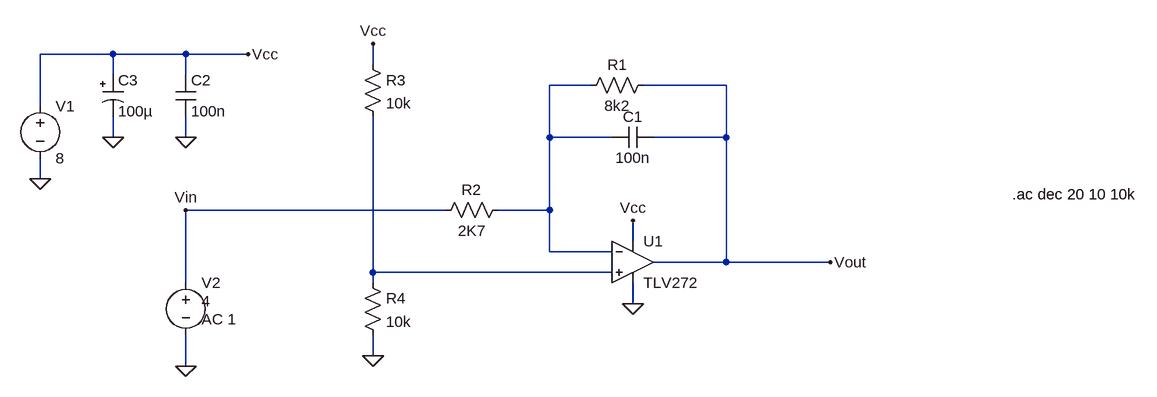
[diagram p0: schematic Exp1.B.2.asc]
Exp1.B.2.asc, the LTspice schematic file:
Version 4
SHEET 1 1456 680
WIRE -160 -96 -272 -96
WIRE -48 -96 -160 -96
WIRE 48 -96 -48 -96
WIRE 240 -80 240 -112
WIRE -160 -64 -160 -96
WIRE -48 -64 -48 -96
WIRE 576 -48 512 -48
WIRE 784 -48 656 -48
WIRE -272 -16 -272 -96
WIRE -160 32 -160 0
WIRE -48 32 -48 0
WIRE 512 32 512 -48
WIRE 608 32 512 32
WIRE 784 32 784 -48
WIRE 784 32 672 32
WIRE -272 96 -272 64
WIRE 352 144 -48 144
WIRE 512 144 512 32
WIRE 512 144 432 144
WIRE 640 192 640 160
WIRE 512 208 512 144
WIRE 608 208 512 208
WIRE 784 224 784 32
WIRE 784 224 672 224
WIRE 944 224 784 224
WIRE 240 240 240 0
WIRE 608 240 240 240
WIRE -48 256 -48 144
WIRE 240 256 240 240
WIRE 640 288 640 256
WIRE 240 368 240 336
WIRE -48 384 -48 336
FLAG -48 384 0
FLAG -272 96 0
FLAG -160 32 0
FLAG -48 32 0
FLAG 48 -96 Vcc
FLAG 240 368 0
FLAG 240 -112 Vcc
FLAG 640 288 0
FLAG -48 144 Vin
FLAG 944 224 Vout
FLAG 640 160 Vcc
SYMBOL voltage -48 240 R0
WINDOW 3 24 44 Left 2
WINDOW 123 24 72 Left 2
WINDOW 39 0 0 Left 0
SYMATTR Value 4
SYMATTR Value2 AC 1
SYMATTR InstName V2
SYMBOL res 224 240 R0
SYMATTR InstName R4
SYMATTR Value 10k
SYMBOL res 224 -96 R0
SYMATTR InstName R3
SYMATTR Value 10k
SYMBOL res 336 160 R270
WINDOW 0 32 56 VTop 2
WINDOW 3 0 56 VBottom 2
SYMATTR InstName R2
SYMATTR Value 2K7
SYMBOL res 560 -32 R270
WINDOW 0 32 56 VTop 2
WINDOW 3 0 56 VBottom 2
SYMATTR InstName R1
SYMATTR Value 8k2
SYMBOL voltage -272 -32 R0
WINDOW 123 0 0 Left 0
WINDOW 39 0 0 Left 0
SYMATTR InstName V1
SYMATTR Value 8
SYMBOL cap -64 -64 R0
SYMATTR InstName C2
SYMATTR Value 100n
SYMBOL polcap -176 -64 R0
SYMATTR InstName C3
SYMATTR Value 100µ
SYMBOL OpAmps\\TLV272 640 224 R0
SYMATTR InstName U1
SYMBOL cap 672 16 R90
WINDOW 0 0 32 VBottom 2
WINDOW 3 32 32 VTop 2
SYMATTR InstName C1
SYMATTR Value 100n
TEXT 1224 120 Left 2 !.ac dec 20 10 10k

The netlist it stands for:
* Exp1.B.2.asc
V2 Vin 0 4 AC 1
R4 N002 0 10k
R3 Vcc N002 10k
R2 Vin N001 2K7
R1 N001 Vout 8k2
V1 Vcc 0 8
C2 Vcc 0 100n
C3 Vcc 0 100µ
* U1: TLV272 (symbol OpAmps\TLV272 not available, pins judged from their places): In+=N002 In-=N001 V+=Vcc V-=0 OUT=Vout
C1 Vout N001 100n
.ac dec 20 10 10k
.backanno
.end